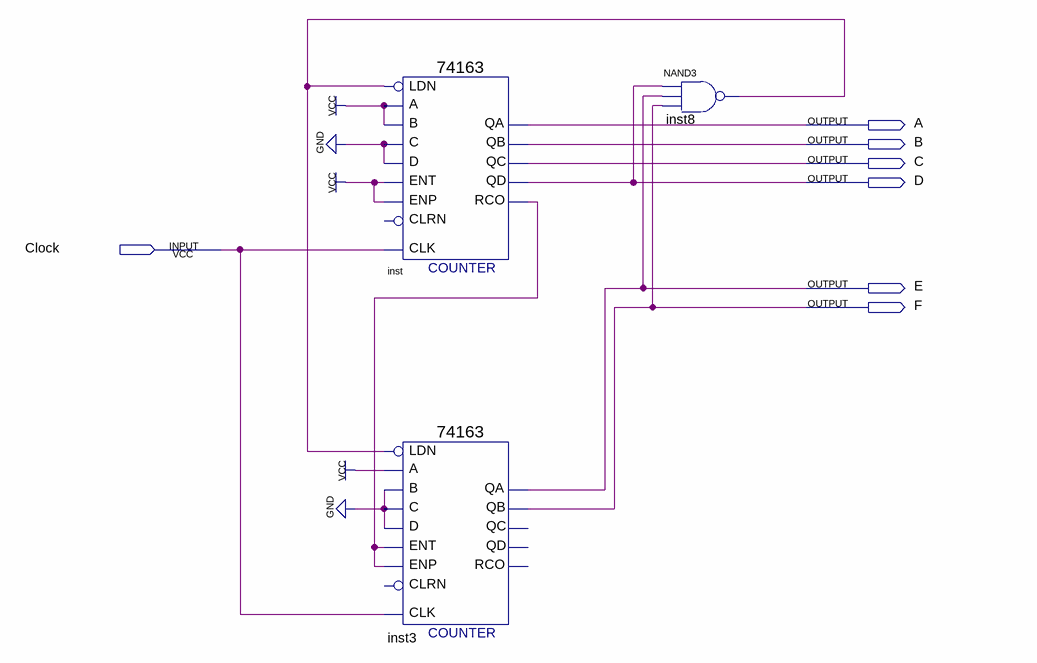
[diagram p0: schematic sheet]
// Quartus schematic 3.bdf as structural Verilog: 3 symbols, 7 pins
module \3  (
  input  Clock,
  output A,
  output B,
  output C,
  output D,
  output E,
  output F
);

  wire inst8_out, inst_rco;

  \74163  inst (
    .C(1'b0), .B(1'b1), .A(1'b1), .ENT(1'b1), .D(1'b0), .CLK(Clock), .ENP(1'b1), .LDN(inst8_out), .QA(A),
    .QB(B), .QC(C), .QD(D), .RCO(inst_rco));  // open: CLRN
  \74163  inst3 (
    .C(1'b0), .B(1'b0), .A(1'b1), .ENT(inst_rco), .D(1'b0), .CLK(Clock), .ENP(inst_rco), .LDN(inst8_out),
    .QA(E), .QB(F));  // open: CLRN, QC, QD, RCO
  nand inst8 (inst8_out, D, E, F);
endmodule
